# EAGLE board Cube-Panel (EAGLE 7.7.0), part 1 of 2
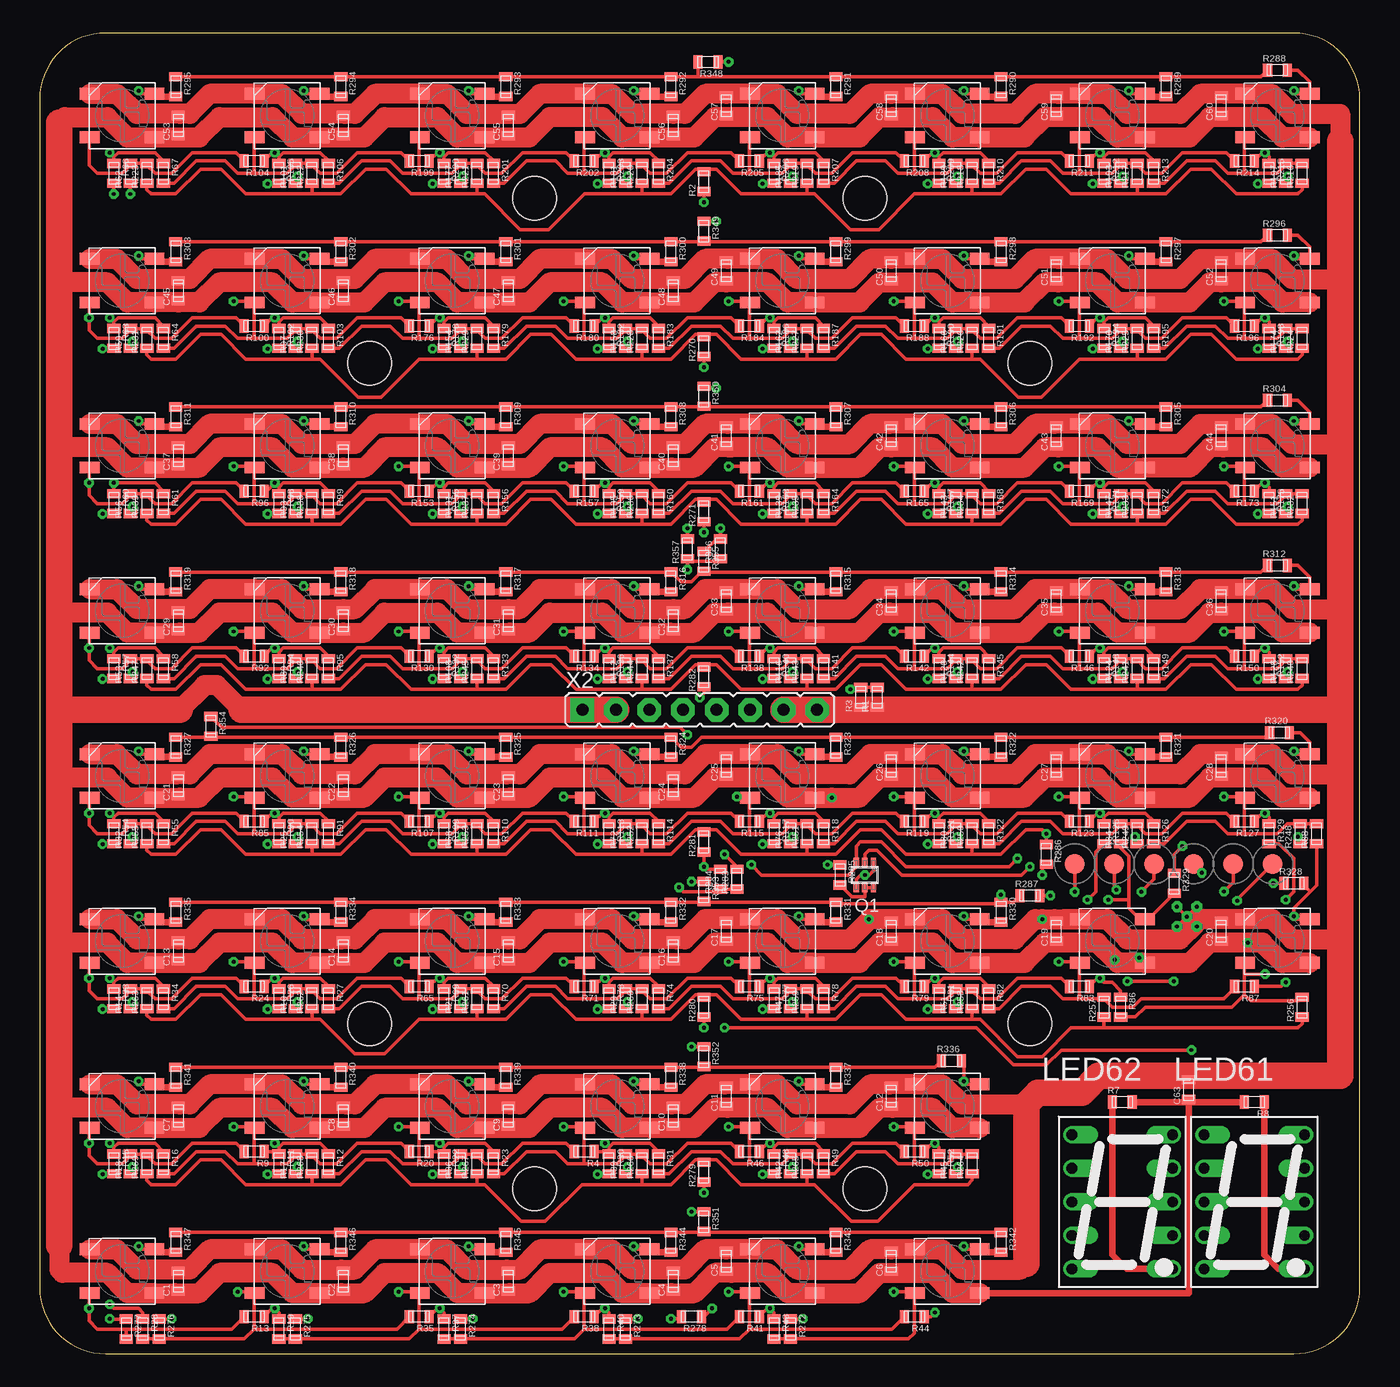
[diagram p8: board, top side]
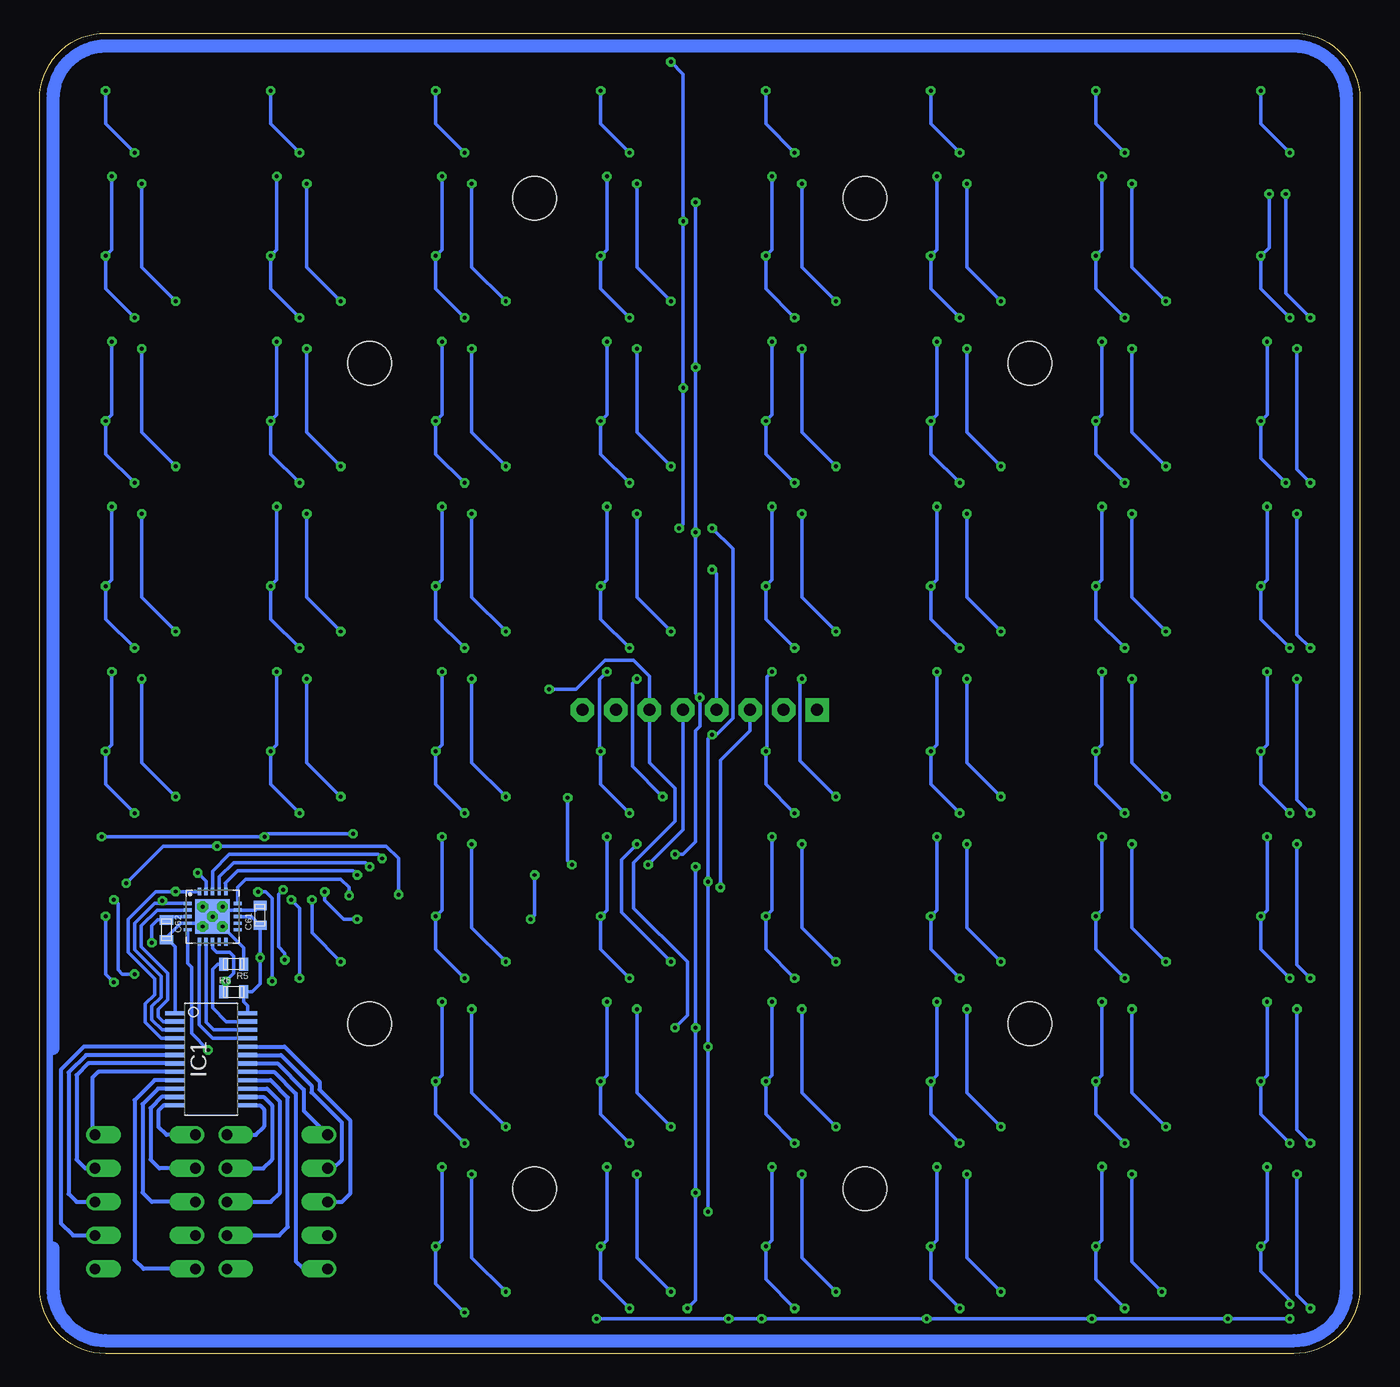
[diagram p9: board, bottom side, seen from below]

Size 100 x 100 mm. Coordinates in mm from the lower left corner, seen from the top.
Outline: 5,0 95,0 arc90 100,5 100,95 arc90 95,100 5,100 arc90 0,95 0,5 arc90 5,0
Copper layers (1*16): Top 0.035mm / dielectric 1.5mm / Bottom 0.035mm
Design rules "default *": minimum track width 0.2mm, minimum drill 0.3mm, track to track 0.2mm, track to pad 0.2mm, pad to pad 0.2mm, via to via 0.2mm, smd to smd 0.2mm, copper to edge 0.5mm, drill to drill 8mil, minimum pad ring 10mil, minimum via ring 8mil, stop-mask expansion 4mil, vias tented up to drill 0.5mm, thermal gap 10mil
Holes 3.3 mm at 25,25 75,25 25,75 75,75 37.5,12.5 62.5,12.5 37.5,87.5 62.5,87.5

## Footprints (pad centres in the part's own frame; a part is rotated, then mirrored left to right if it is on the bottom)
0603 = smd 0.7 x 1: P$1 -0.75,0; P$2 0.75,0
SSOP24-150-0.635 = smd 1.5 x 0.3: 1 -2.75,3.493; 2 -2.75,2.857; 3 -2.75,2.223; 4 -2.75,1.587; 5 -2.75,0.953; 6 -2.75,0.318; 7 -2.75,-0.318; 8 -2.75,-0.953; 9 -2.75,-1.587; 10 -2.75,-2.223; 11 -2.75,-2.857; 12 -2.75,-3.493; 13 2.75,-3.493; 14 2.75,-2.857; 15 2.75,-2.223; 16 2.75,-1.587; 17 2.75,-0.953; 18 2.75,-0.318; 19 2.75,0.318; 20 2.75,0.953; 21 2.75,1.587; 22 2.75,2.223; 23 2.75,2.857; 24 2.75,3.493
QFN-20 = smd 0.6 x 0.25: 1 -1.9,1; 2 -1.9,0.5; 3 -1.9,0; 4 -1.9,-0.5; 5 -1.9,-1; 11 1.9,-1; 12 1.9,-0.5; 13 1.9,0; 14 1.9,0.5; 15 1.9,1 | smd 0.25 x 0.6: 6 -1,-1.9; 7 -0.5,-1.9; 8 0,-1.9; 9 0.5,-1.9; 10 1,-1.9; 16 1,1.9; 17 0.5,1.9; 18 0,1.9; 19 -0.5,1.9; 20 -1,1.9 | smd 2.6 x 2.6: PAD 0,0 | drill 0.3 octagon: PAD$1 0,0; PAD$2 0.75,-0.75; PAD$3 -0.75,-0.75; PAD$4 -0.75,0.75; PAD$5 0.75,0.75
WS2812B = smd 1.5 x 0.9: DIN 2.45,1.65; DOUT -2.45,-1.65; GND 2.45,-1.65; VDD -2.45,1.65
7SEG-13 = drill 0.813 offset: 1 -3.81,5.08; 2 -3.81,2.54; 3 -3.81,0; 4 -3.81,-2.54; 5 -3.81,-5.08; 6 3.81,-5.08; 7 3.81,-2.54; 8 3.81,0; 9 3.81,2.54; 10 3.81,5.08
SOT-363(SC-88) = smd 0.7 x 0.4: 1 0.95,-0.65; 2 0.95,0; 3 0.95,0.65; 4 -0.95,0.65; 5 -0.95,0; 6 -0.95,-0.65
TP[1.5][R] = smd 1.5 x 1.5: P$1 0,0
JP8 = drill 0.914 pad 1.778 square: 1 -8.89,0 | drill 0.914 pad 1.778 octagon: 2 -6.35,0; 3 -3.81,0; 4 -1.27,0; 5 1.27,0; 6 3.81,0; 7 6.35,0; 8 8.89,0

## Placement (x,y rotation side)
C1  [0603]  10.5,5.5 90 top
C2  [0603]  23,5.5 90 top
C3  [0603]  35.5,5.5 90 top
C4  [0603]  48,5.5 90 top
C5  [0603]  52,7 90 top
C6  [0603]  64.5,7 90 top
C7  [0603]  10.5,18 90 top
C8  [0603]  23,18 90 top
C9  [0603]  35.5,18 90 top
C10  [0603]  48,18 90 top
C11  [0603]  52,19.5 90 top
C12  [0603]  64.5,19.5 90 top
C13  [0603]  10.5,30.5 90 top
C14  [0603]  23,30.5 90 top
C15  [0603]  35.5,30.5 90 top
C16  [0603]  48,30.5 90 top
C17  [0603]  52,32 90 top
C18  [0603]  64.5,32 90 top
C19  [0603]  77,32 90 top
C20  [0603]  89.5,32 90 top
C21  [0603]  10.5,43 90 top
C22  [0603]  23,43 90 top
C23  [0603]  35.5,43 90 top
C24  [0603]  48,43 90 top
C25  [0603]  52,44.5 90 top
C26  [0603]  64.5,44.5 90 top
C27  [0603]  77,44.5 90 top
C28  [0603]  89.5,44.5 90 top
C29  [0603]  10.5,55.5 90 top
C30  [0603]  23,55.5 90 top
C31  [0603]  35.5,55.5 90 top
C32  [0603]  48,55.5 90 top
C33  [0603]  52,57 90 top
C34  [0603]  64.5,57 90 top
C35  [0603]  77,57 90 top
C36  [0603]  89.5,57 90 top
C37  [0603]  10.5,68 90 top
C38  [0603]  23,68 90 top
C39  [0603]  35.5,68 90 top
C40  [0603]  48,68 90 top
C41  [0603]  52,69.5 90 top
C42  [0603]  64.5,69.5 90 top
C43  [0603]  77,69.5 90 top
C44  [0603]  89.5,69.5 90 top
C45  [0603]  10.5,80.5 90 top
C46  [0603]  23,80.5 90 top
C47  [0603]  35.5,80.5 90 top
C48  [0603]  48,80.5 90 top
C49  [0603]  52,82 90 top
C50  [0603]  64.5,82 90 top
C51  [0603]  77,82 90 top
C52  [0603]  89.5,82 90 top
C53  [0603]  10.5,93 90 top
C54  [0603]  23,93 90 top
C55  [0603]  35.5,93 90 top
C56  [0603]  48,93 90 top
C57  [0603]  52,94.5 90 top
C58  [0603]  64.5,94.5 90 top
C59  [0603]  77,94.5 90 top
C60  [0603]  89.5,94.5 90 top
C61  [0603]  83.3,33.2 90 bottom
C62  [0603]  90.4,32.1 270 bottom
C63  [0603]  87.03,20 90 top
IC1  MBI5041-GP  [SSOP24-150-0.635]  87,22.3 0 bottom
IC2  ATTINY(261/461/861)V-MAZ  [QFN-20]  86.9,33.1 0 bottom
LED1  WS2812B  [WS2812B]  6.25,6.25 180 top
LED2  WS2812B  [WS2812B]  18.75,6.25 180 top
LED3  WS2812B  [WS2812B]  31.25,6.25 180 top
LED4  WS2812B  [WS2812B]  43.75,6.25 180 top
LED5  WS2812B  [WS2812B]  56.25,6.25 180 top
LED6  WS2812B  [WS2812B]  68.75,6.25 180 top
LED7  WS2812B  [WS2812B]  6.25,18.75 180 top
LED8  WS2812B  [WS2812B]  18.75,18.75 180 top
LED9  WS2812B  [WS2812B]  31.25,18.75 180 top
LED10  WS2812B  [WS2812B]  43.75,18.75 180 top
LED11  WS2812B  [WS2812B]  56.25,18.75 180 top
LED12  WS2812B  [WS2812B]  68.75,18.75 180 top
LED13  WS2812B  [WS2812B]  6.25,31.25 180 top
LED14  WS2812B  [WS2812B]  18.75,31.25 180 top
LED15  WS2812B  [WS2812B]  31.25,31.25 180 top
LED16  WS2812B  [WS2812B]  43.75,31.25 180 top
LED17  WS2812B  [WS2812B]  56.25,31.25 180 top
LED18  WS2812B  [WS2812B]  68.75,31.25 180 top
LED19  WS2812B  [WS2812B]  81.25,31.25 180 top
LED20  WS2812B  [WS2812B]  93.75,31.25 180 top
LED21  WS2812B  [WS2812B]  6.25,43.75 180 top
LED22  WS2812B  [WS2812B]  18.75,43.75 180 top
LED23  WS2812B  [WS2812B]  31.25,43.75 180 top
LED24  WS2812B  [WS2812B]  43.75,43.75 180 top
LED25  WS2812B  [WS2812B]  56.25,43.75 180 top
LED26  WS2812B  [WS2812B]  68.75,43.75 180 top
LED27  WS2812B  [WS2812B]  81.25,43.75 180 top
LED28  WS2812B  [WS2812B]  93.75,43.75 180 top
LED29  WS2812B  [WS2812B]  6.25,56.25 180 top
LED30  WS2812B  [WS2812B]  18.75,56.25 180 top
LED31  WS2812B  [WS2812B]  31.25,56.25 180 top
LED32  WS2812B  [WS2812B]  43.75,56.25 180 top
LED33  WS2812B  [WS2812B]  56.25,56.25 180 top
LED34  WS2812B  [WS2812B]  68.75,56.25 180 top
LED35  WS2812B  [WS2812B]  81.25,56.25 180 top
LED36  WS2812B  [WS2812B]  93.75,56.25 180 top
LED37  WS2812B  [WS2812B]  6.25,68.75 180 top
LED38  WS2812B  [WS2812B]  18.75,68.75 180 top
LED39  WS2812B  [WS2812B]  31.25,68.75 180 top
LED40  WS2812B  [WS2812B]  43.75,68.75 180 top
LED41  WS2812B  [WS2812B]  56.25,68.75 180 top
LED42  WS2812B  [WS2812B]  68.75,68.75 180 top
LED43  WS2812B  [WS2812B]  81.25,68.75 180 top
LED44  WS2812B  [WS2812B]  93.75,68.75 180 top
LED45  WS2812B  [WS2812B]  6.25,81.25 180 top
LED46  WS2812B  [WS2812B]  18.75,81.25 180 top
LED47  WS2812B  [WS2812B]  31.25,81.25 180 top
LED48  WS2812B  [WS2812B]  43.75,81.25 180 top
LED49  WS2812B  [WS2812B]  56.25,81.25 180 top
LED50  WS2812B  [WS2812B]  68.75,81.25 180 top
LED51  WS2812B  [WS2812B]  81.25,81.25 180 top
LED52  WS2812B  [WS2812B]  93.75,81.25 180 top
LED53  WS2812B  [WS2812B]  6.25,93.75 180 top
LED54  WS2812B  [WS2812B]  18.75,93.75 180 top
LED55  WS2812B  [WS2812B]  31.25,93.75 180 top
LED56  WS2812B  [WS2812B]  43.75,93.75 180 top
LED57  WS2812B  [WS2812B]  56.25,93.75 180 top
LED58  WS2812B  [WS2812B]  68.75,93.75 180 top
LED59  WS2812B  [WS2812B]  81.25,93.75 180 top
LED60  WS2812B  [WS2812B]  93.75,93.75 180 top
LED61  INND-TS40AB  [7SEG-13]  92,11.5 0 top
LED62  INND-TS40AB  [7SEG-13]  82,11.5 0 top
Q1  DUAL_BJT_NPN_BIAS-PUMH2  [SOT-363(SC-88)]  62.5,36.25 90 top
R1  [0603]  63.44,49.7 90 top
R2  [0603]  50.31,88.75 90 top
R3  [0603]  62.19,49.7 90 top
R4  [0603]  41.25,15.31 180 top
R5  [0603]  85.3,29.5 180 bottom
R6  [0603]  85.3,27.4 0 bottom
R7  [0603]  82,19.06 0 top
R8  [0603]  92,19.06 180 top
R9  [0603]  16.25,15.31 180 top
R10  [0603]  19.38,26.88 90 top
R11  [0603]  18.12,14.38 270 top
R12  [0603]  21.88,14.38 270 top
R13  [0603]  16.25,2.81 180 top
R14  [0603]  6.88,26.88 90 top
R15  [0603]  5.62,14.38 270 top
R16  [0603]  9.38,14.38 270 top
R17  [0603]  19.38,14.38 90 top
R18  [0603]  6.88,14.38 90 top
R19  [0603]  18.12,1.88 270 top
R20  [0603]  28.75,15.31 180 top
R21  [0603]  31.88,26.88 90 top
R22  [0603]  30.62,14.38 270 top
R23  [0603]  34.38,14.38 270 top
R24  [0603]  16.25,27.81 180 top
R25  [0603]  19.38,39.38 90 top
R26  [0603]  18.12,26.88 270 top
R27  [0603]  21.88,26.88 270 top
R28  [0603]  7.81,1.88 270 top
R29  [0603]  44.38,26.88 90 top
R30  [0603]  43.12,14.38 270 top
R31  [0603]  46.88,14.38 270 top
R32  [0603]  6.88,39.38 90 top
R33  [0603]  5.62,26.88 270 top
R34  [0603]  9.38,26.88 270 top
R35  [0603]  28.75,2.81 180 top
R36  [0603]  31.88,14.38 90 top
R37  [0603]  30.62,1.88 270 top
R38  [0603]  41.25,2.81 180 top
R39  [0603]  44.38,14.38 90 top
R40  [0603]  43.12,1.88 270 top
R41  [0603]  53.75,2.81 180 top
R42  [0603]  56.88,14.38 90 top
R43  [0603]  55.62,1.88 270 top
R44  [0603]  66.25,2.81 180 top
R45  [0603]  69.38,14.38 90 top
R46  [0603]  53.75,15.31 180 top
R47  [0603]  56.88,26.88 90 top
R48  [0603]  55.62,14.38 270 top
R49  [0603]  59.38,14.38 270 top
R50  [0603]  66.25,15.31 180 top
R51  [0603]  69.38,26.88 90 top
R52  [0603]  68.12,14.38 270 top
R53  [0603]  6.88,51.88 90 top
R54  [0603]  5.62,39.38 270 top
R55  [0603]  9.38,39.38 270 top
R56  [0603]  6.88,64.38 90 top
R57  [0603]  5.62,51.88 270 top
R58  [0603]  9.38,51.88 270 top
R59  [0603]  6.88,76.88 90 top
R60  [0603]  5.62,64.38 270 top
R61  [0603]  9.38,64.38 270 top
R62  [0603]  6.88,89.38 90 top
R63  [0603]  5.62,76.88 270 top
R64  [0603]  9.38,76.88 270 top
R65  [0603]  28.75,27.81 180 top
R66  [0603]  5.62,89.38 270 top
R67  [0603]  9.38,89.38 270 top
R68  [0603]  31.88,39.38 90 top
R69  [0603]  30.62,26.88 270 top
R70  [0603]  34.38,26.88 270 top
R71  [0603]  41.25,27.81 180 top
R72  [0603]  44.38,39.38 90 top
R73  [0603]  43.12,26.88 270 top
R74  [0603]  46.88,26.88 270 top
R75  [0603]  53.75,27.81 180 top
R76  [0603]  56.88,39.38 90 top
R77  [0603]  55.62,26.88 270 top
R78  [0603]  59.38,26.88 270 top
R79  [0603]  66.25,27.81 180 top
R80  [0603]  69.38,39.38 90 top
R81  [0603]  68.12,26.88 270 top
R82  [0603]  71.88,26.88 270 top
R83  [0603]  78.75,27.81 180 top
R84  [0603]  81.88,39.38 90 top
R85  [0603]  16.25,40.31 180 top
R86  [0603]  81.88,26.25 270 top
R87  [0603]  91.25,27.81 180 top
R88  [0603]  96.72,39.38 90 top
R89  [0603]  19.38,51.88 90 top
R90  [0603]  18.12,39.38 270 top
R91  [0603]  21.88,39.38 270 top
R92  [0603]  16.25,52.81 180 top
R93  [0603]  19.38,64.38 90 top
R94  [0603]  18.12,51.88 270 top
R95  [0603]  21.88,51.88 270 top
R96  [0603]  16.25,65.31 180 top
R97  [0603]  19.38,76.88 90 top
R98  [0603]  18.12,64.38 270 top
R99  [0603]  21.88,64.38 270 top
R100  [0603]  16.25,77.81 180 top
R101  [0603]  19.38,89.38 90 top
R102  [0603]  18.12,76.88 270 top
R103  [0603]  21.88,76.88 270 top
R104  [0603]  16.25,90.31 180 top
R105  [0603]  18.12,89.38 270 top
R106  [0603]  21.88,89.38 270 top
R107  [0603]  28.75,40.31 180 top
R108  [0603]  31.88,51.88 90 top
R109  [0603]  30.62,39.38 270 top
R110  [0603]  34.38,39.38 270 top
R111  [0603]  41.25,40.31 180 top
R112  [0603]  44.38,51.88 90 top
R113  [0603]  43.12,39.38 270 top
R114  [0603]  46.88,39.38 270 top
R115  [0603]  53.75,40.31 180 top
R116  [0603]  56.88,51.88 90 top
R117  [0603]  55.62,39.38 270 top
R118  [0603]  59.38,39.38 270 top
R119  [0603]  66.25,40.31 180 top
R120  [0603]  69.38,51.88 90 top
R121  [0603]  68.12,39.38 270 top
R122  [0603]  71.88,39.38 270 top
R123  [0603]  78.75,40.31 180 top
R124  [0603]  81.88,51.88 90 top
R125  [0603]  80.62,39.38 270 top
R126  [0603]  84.38,39.38 270 top
R127  [0603]  91.25,40.31 180 top
R128  [0603]  94.38,51.88 90 top
R129  [0603]  93.12,39.38 270 top
R130  [0603]  28.75,52.81 180 top
R131  [0603]  31.88,64.38 90 top
R132  [0603]  30.62,51.88 270 top
R133  [0603]  34.38,51.88 270 top
R134  [0603]  41.25,52.81 180 top
R135  [0603]  44.38,64.38 90 top
R136  [0603]  43.12,51.88 270 top
R137  [0603]  46.88,51.88 270 top
R138  [0603]  53.75,52.81 180 top
R139  [0603]  56.88,64.38 90 top
R140  [0603]  55.62,51.88 270 top
R141  [0603]  59.38,51.88 270 top
R142  [0603]  66.25,52.81 180 top
R143  [0603]  69.38,64.38 90 top
R144  [0603]  68.12,51.88 270 top
R145  [0603]  71.88,51.88 270 top
R146  [0603]  78.75,52.81 180 top
R147  [0603]  81.88,64.38 90 top
R148  [0603]  80.62,51.88 270 top
R149  [0603]  84.38,51.88 270 top
R150  [0603]  91.25,52.81 180 top
R151  [0603]  94.38,64.38 90 top
R152  [0603]  93.12,51.88 270 top
R153  [0603]  28.75,65.31 180 top
R154  [0603]  31.88,76.88 90 top
R155  [0603]  30.62,64.38 270 top
R156  [0603]  34.38,64.38 270 top
R157  [0603]  41.25,65.31 180 top
R158  [0603]  44.38,76.88 90 top
R159  [0603]  43.12,64.38 270 top
R160  [0603]  46.88,64.38 270 top
R161  [0603]  53.75,65.31 180 top
R162  [0603]  56.88,76.88 90 top
R163  [0603]  55.62,64.38 270 top
R164  [0603]  59.38,64.38 270 top
R165  [0603]  66.25,65.31 180 top
R166  [0603]  69.38,76.88 90 top
R167  [0603]  68.12,64.38 270 top
R168  [0603]  71.88,64.38 270 top
R169  [0603]  78.75,65.31 180 top
R170  [0603]  81.88,76.88 90 top
R171  [0603]  80.62,64.38 270 top
R172  [0603]  84.38,64.38 270 top
R173  [0603]  91.25,65.31 180 top
R174  [0603]  94.38,76.88 90 top
R175  [0603]  93.12,64.38 270 top
R176  [0603]  28.75,77.81 180 top
R177  [0603]  31.88,89.38 90 top
R178  [0603]  30.62,76.88 270 top
R179  [0603]  34.38,76.88 270 top
R180  [0603]  41.25,77.81 180 top
R181  [0603]  44.38,89.38 90 top
R182  [0603]  43.12,76.88 270 top
R183  [0603]  46.88,76.88 270 top
R184  [0603]  53.75,77.81 180 top
R185  [0603]  56.88,89.38 90 top
R186  [0603]  55.62,76.88 270 top
R187  [0603]  59.38,76.88 270 top
R188  [0603]  66.25,77.81 180 top
R189  [0603]  69.38,89.38 90 top
R190  [0603]  68.12,76.88 270 top
R191  [0603]  71.88,76.88 270 top
R192  [0603]  78.75,77.81 180 top
R193  [0603]  81.88,89.38 90 top
R194  [0603]  80.62,76.88 270 top
R195  [0603]  84.38,76.88 270 top
R196  [0603]  91.25,77.81 180 top
R197  [0603]  94.38,89.38 90 top
R198  [0603]  93.12,76.88 270 top
R199  [0603]  28.75,90.31 180 top
R200  [0603]  30.62,89.38 270 top
R201  [0603]  34.38,89.38 270 top
R202  [0603]  41.25,90.31 180 top
R203  [0603]  43.12,89.38 270 top
R204  [0603]  46.88,89.38 270 top
R205  [0603]  53.75,90.31 180 top
R206  [0603]  55.62,89.38 270 top
R207  [0603]  59.38,89.38 270 top
R208  [0603]  66.25,90.31 180 top
R209  [0603]  68.12,89.38 270 top
R210  [0603]  71.88,89.38 270 top
R211  [0603]  78.75,90.31 180 top
R212  [0603]  80.62,89.38 270 top
R213  [0603]  84.38,89.38 270 top
R214  [0603]  91.25,90.31 180 top
R215  [0603]  93.12,89.38 270 top
R216  [0603]  95.62,89.38 90 top
R217  [0603]  83.12,89.38 90 top
R218  [0603]  70.62,89.38 90 top
R219  [0603]  58.12,89.38 90 top
R220  [0603]  45.62,89.38 90 top
R221  [0603]  33.12,89.38 90 top
R222  [0603]  20.62,89.38 90 top
R223  [0603]  8.12,89.38 90 top
R224  [0603]  95.62,76.88 90 top
R225  [0603]  83.12,76.88 90 top
R226  [0603]  70.62,76.88 90 top
R227  [0603]  58.12,76.88 90 top
R228  [0603]  45.62,76.88 90 top
R229  [0603]  33.12,76.88 90 top
R230  [0603]  20.62,76.88 90 top
R231  [0603]  8.12,76.88 90 top
R232  [0603]  95.62,64.38 90 top
R233  [0603]  83.12,64.38 90 top
R234  [0603]  70.62,64.38 90 top
R235  [0603]  58.12,64.38 90 top
R236  [0603]  45.62,64.38 90 top
R237  [0603]  33.12,64.38 90 top
R238  [0603]  20.62,64.38 90 top
R239  [0603]  8.12,64.38 90 top
R240  [0603]  95.62,51.88 90 top
R241  [0603]  83.12,51.88 90 top
R242  [0603]  70.62,51.88 90 top
R243  [0603]  58.12,51.88 90 top
R244  [0603]  45.62,51.88 90 top
R245  [0603]  33.12,51.88 90 top
R246  [0603]  20.62,51.88 90 top
R247  [0603]  8.12,51.88 90 top
R248  [0603]  95.47,39.38 90 top
R249  [0603]  83.12,39.38 90 top
R250  [0603]  70.62,39.38 90 top
R251  [0603]  58.12,39.38 90 top
R252  [0603]  45.62,39.38 90 top
R253  [0603]  33.12,39.38 90 top
R254  [0603]  20.62,39.38 90 top
R255  [0603]  8.12,39.38 90 top
R256  [0603]  95.62,26.25 90 top
R257  [0603]  80.62,26.25 90 top
R258  [0603]  70.62,26.88 90 top
R259  [0603]  58.12,26.88 90 top
R260  [0603]  45.62,26.88 90 top
R261  [0603]  33.12,26.88 90 top
R262  [0603]  20.62,26.88 90 top
R263  [0603]  8.12,26.88 90 top
R264  [0603]  70.62,14.38 90 top
R265  [0603]  58.12,14.38 90 top
R266  [0603]  45.62,14.38 90 top
R267  [0603]  33.12,14.38 90 top
R268  [0603]  20.62,14.38 90 top
R269  [0603]  8.12,14.38 90 top
R270  [0603]  50.31,76.25 90 top
R271  [0603]  50.31,63.75 90 top
R272  [0603]  56.88,1.88 270 top
R273  [0603]  44.38,1.88 270 top
R274  [0603]  31.88,1.88 270 top
R275  [0603]  19.38,1.88 270 top
R276  [0603]  9.06,1.88 270 top
R277  [0603]  6.56,1.88 270 top
R278  [0603]  49.38,2.81 180 top
R279  [0603]  50.31,13.75 90 top
R280  [0603]  50.31,26.25 90 top
R281  [0603]  50.31,38.75 90 top
R282  [0603]  50.31,51.25 90 top
R283  [0603]  52.81,35.94 90 top
R284  [0603]  51.56,35.94 90 top
R285  [0603]  60.62,36.25 270 top
R286  [0603]  76.25,37.81 270 top
R287  [0603]  75,34.69 0 top
R288  [0603]  93.75,97.19 0 top
R289  [0603]  85.31,95.94 270 top
R290  [0603]  72.81,95.94 270 top
R291  [0603]  60.31,95.94 270 top
R292  [0603]  47.81,95.94 270 top
R293  [0603]  35.31,95.94 270 top
R294  [0603]  22.81,95.94 270 top
R295  [0603]  10.31,95.94 270 top
R296  [0603]  93.75,84.69 0 top
R297  [0603]  85.31,83.44 270 top
R298  [0603]  72.81,83.44 270 top
R299  [0603]  60.31,83.44 270 top
R300  [0603]  47.81,83.44 270 top
R301  [0603]  35.31,83.44 270 top
R302  [0603]  22.81,83.44 270 top
R303  [0603]  10.31,83.44 270 top
R304  [0603]  93.75,72.19 0 top
R305  [0603]  85.31,70.94 270 top
R306  [0603]  72.81,70.94 270 top
R307  [0603]  60.31,70.94 270 top
R308  [0603]  47.81,70.94 270 top
R309  [0603]  35.31,70.94 270 top
R310  [0603]  22.81,70.94 270 top
R311  [0603]  10.31,70.94 270 top
R312  [0603]  93.75,59.69 0 top
R313  [0603]  85.31,58.44 270 top
R314  [0603]  72.81,58.44 270 top
R315  [0603]  60.31,58.44 270 top
R316  [0603]  47.81,58.44 270 top
R317  [0603]  35.31,58.44 270 top
R318  [0603]  22.81,58.44 270 top
R319  [0603]  10.31,58.44 270 top
R320  [0603]  93.91,47.03 0 top
R321  [0603]  85.31,45.94 270 top
R322  [0603]  72.81,45.94 270 top
R323  [0603]  60.31,45.94 270 top
R324  [0603]  47.81,45.94 270 top
R325  [0603]  35.31,45.94 270 top
R326  [0603]  22.81,45.94 270 top
R327  [0603]  10.31,45.94 270 top
R328  [0603]  95,35.62 0 top
R329  [0603]  85.94,35.62 270 top
R330  [0603]  72.81,33.44 270 top
R331  [0603]  60.31,33.44 270 top
R332  [0603]  47.81,33.44 270 top
R333  [0603]  35.31,33.44 270 top
R334  [0603]  22.81,33.44 270 top
R335  [0603]  10.31,33.44 270 top
R336  [0603]  69.06,22.19 0 top
R337  [0603]  60.31,20.94 270 top
R338  [0603]  47.81,20.94 270 top
R339  [0603]  35.31,20.94 270 top
R340  [0603]  22.81,20.94 270 top
R341  [0603]  10.31,20.94 270 top
R342  [0603]  72.81,8.44 270 top
R343  [0603]  60.31,8.44 270 top
R344  [0603]  47.81,8.44 270 top
R345  [0603]  35.31,8.44 270 top
R346  [0603]  22.81,8.44 270 top
R347  [0603]  10.31,8.44 270 top
R348  [0603]  50.62,97.81 180 top
R349  [0603]  50.31,85 270 top
R350  [0603]  50.31,72.5 270 top
R351  [0603]  50.31,10 270 top
R352  [0603]  50.31,22.5 270 top
R353  [0603]  50.31,35 270 top
R354  [0603]  12.97,47.5 270 top
R355  [0603]  50.31,60 270 top
R356  [0603]  51.56,60.94 90 top
R357  [0603]  49.06,60.94 90 top
TP1  TP  [TP[1.5][R]]  81.4,37.1 0 top
TP2  TP  [TP[1.5][R]]  84.4,37.1 0 top
TP3  TP  [TP[1.5][R]]  87.4,37.1 0 top
TP4  TP  [TP[1.5][R]]  90.4,37.1 0 top
TP5  TP  [TP[1.5][R]]  93.4,37.1 0 top
TP6  TP  [TP[1.5][R]]  78.4,37.1 0 top
X2  JP8ER  [JP8]  50,48.75 0 top

## Tracks (layer width: path | path; a pad name or v marks a point on that pad's centre or on a via)
A1
  Bottom 0.3: LED62.10 83.62,16.58 83,17.2 83,18.5 83.31,18.81 IC1.13
A2
  Bottom 0.3: IC1.8 95.55,21.35 96,20.9 96,16.77 LED61.10
B1
  Bottom 0.3: LED62.9 83.06,14.04 82.4,14.7 82.4,18.8 83.04,19.44 IC1.14
B2
  Bottom 0.3: LED61.9 96.54,14.04 97.2,14.7 97.2,21.1 96.32,21.98 IC1.7
C1
  Bottom 0.3: LED62.8 82.5,11.5 81.8,12.2 81.8,19.1 82.78,20.08 IC1.15
C2
  Bottom 0.3: IC1.6 96.48,22.62 97.8,21.3 97.8,12.1 97.2,11.5 LED61.8
D1
  Bottom 0.3: LED62.5 80.02,6.42 80.6,7 80.6,19.7 82.25,21.35 IC1.17
D2
  Bottom 0.3: LED61.5 92.12,6.42 92.8,7.1 92.8,19.2 91.29,20.71 IC1.9
E1
  Bottom 0.3: LED62.1 80,18.39 80,20 81.98,21.98 IC1.18
E2
  Bottom 0.3: LED61.1 90.38,16.58 91,17.2 91,18.4 90.59,18.81 IC1.12
F1
  Bottom 0.3: LED62.2 77.76,14.04 77.1,14.7 77.1,17.5 79.4,19.8 79.4,20.3 81.72,22.62 IC1.19
F2
  Bottom 0.3: LED61.2 90.94,14.04 91.6,14.7 91.6,18.6 90.76,19.44 IC1.11
G1
  Bottom 0.3: LED62.3 77.1,11.5 76.5,12.1 76.5,17.7 78.8,20 78.8,20.6 81.45,23.25 IC1.20
G2
  Bottom 0.3: LED61.3 91.5,11.5 92.2,12.2 92.2,18.9 91.02,20.08 IC1.10
GCLK
  Bottom 0.25: IC1.21 86.89,23.89 87.9,24.9 IC2.6
GND  (via drill 0.3)
  Top 0.25: IC2.PAD$5 IC2.PAD | IC2.PAD IC2.PAD$4 | IC2.PAD$2 IC2.PAD | 87.9,32.9 87.7,33.1 IC2.PAD | TP6.P$1 v78.4,34.98 | C20.P$2 89.5,32.89 | R3.P$1 62.19,48.75 | R1.P$1 63.44,48.75 | v62.81,32.9 62.81,32.81 | Q1.4 61.85,35.91 62.19,36.25 v62.5,36.25 62.81,36.25 63.15,36.59 Q1.1
  Top 0.5: C21.P$2 10.38,43.88 | C22.P$2 22.88,43.88 | C23.P$2 35.38,43.88 | C24.P$2 48.12,43.88 | C25.P$2 52.1,45.25 52.25,45.4 | C26.P$2 64.5,45.27 64.62,45.4 | C27.P$2 77.1,45.25 77.25,45.4 | C28.P$2 89.5,45.27 89.62,45.4 | C36.P$2 89.5,57.77 89.62,57.9 | C35.P$2 77,57.77 76.88,57.9 | C34.P$2 64.5,57.9 | C33.P$2 51.77,57.75 51.62,57.9 | C32.P$2 48,56.38 | C31.P$2 35.5,56.38 | C30.P$2 23,56.38 | C29.P$2 10.62,56.38 | C37.P$2 10.75,68.75 10.88,68.88 | C38.P$2 23.12,68.75 23.25,68.88 | C39.P$2 35.38,68.88 | C40.P$2 48.12,68.88 | C41.P$2 52,70.28 52.12,70.4 | C42.P$2 64.5,70.28 64.38,70.4 | C43.P$2 77,70.28 76.88,70.4 | C44.P$2 89.5,70.4 | C52.P$2 89.5,82.9 | C51.P$2 77,82.78 77.12,82.9 | C50.P$2 64.5,82.9 | C49.P$2 52,82.78 52.12,82.9 | C48.P$2 48,81.38 | C47.P$2 35.38,81.38 | C46.P$2 22.88,81.38 | C45.P$2 10.5,81.38 | C53.P$2 10.62,93.88 | C54.P$2 23,94.25 23.12,94.38 23.12,93.88 | C55.P$2 35.38,93.88 | C56.P$2 48,93.88 | C57.P$2 52,95.4 | C58.P$2 64.5,95.4 | C59.P$2 77,95.28 77.12,95.4 | C60.P$2 89.6,95.25 89.75,95.4 | C19.P$2 77,32.77 76.88,32.9 | C18.P$2 64.72,32.75 64.88,32.9 | C17.P$2 52,32.77 51.88,32.9 | C16.P$2 48.12,31.25 48.25,31.38 | C15.P$2 35.5,31.38 | C14.P$2 22.88,31.38 | C13.P$2 10.5,31.38 | C7.P$2 10.62,18.88 | C8.P$2 23.12,18.75 23.25,18.88 | C9.P$2 35.62,18.88 | C10.P$2 47.88,18.88 | C11.P$2 52,20.27 51.88,20.4 | C12.P$2 64.5,20.27 64.38,20.4 | C6.P$2 64.5,7.9 | C5.P$2 52,7.9 | C4.P$2 47.75,6.25 47.62,6.38 | C3.P$2 35.38,6.38 | C2.P$2 22.88,6.38 | C1.P$2 10.12,6.25 10,6.38 | C20.P$2 89.65,32.9 90,32.9 | IC2.PAD$3 87.5,32.5 | C63.P$2 86.88,20.75 86.88,21.05
  Top 1.5: LED53.GND 5.85,95.4 7.38,93.88 10.62,93.88 11.38,93.88 12.9,95.4 LED54.GND 18.35,95.4 19.88,93.88 23.12,93.88 23.88,93.88 25.4,95.4 LED55.GND 30.85,95.4 32.38,93.88 35.38,93.88 36.38,93.88 37.9,95.4 LED56.GND 43.35,95.4 44.88,93.88 48,93.88 48.88,93.88 50.4,95.4 52,95.4 LED57.GND 55.85,95.4 57.38,93.88 61.38,93.88 62.9,95.4 64.5,95.4 LED58.GND 68.35,95.4 69.88,93.88 73.88,93.88 75.4,95.4 77.12,95.4 LED59.GND 80.85,95.4 82.38,93.88 86.38,93.88 87.9,95.4 89.75,95.4 LED60.GND 93.35,95.4 94.88,93.88 98.5,93.88 98.5,91.8 | LED45.GND 5.85,82.9 7.38,81.38 10.5,81.38 11.38,81.38 12.9,82.9 LED46.GND 18.35,82.9 19.88,81.38 22.88,81.38 23.88,81.38 25.4,82.9 LED47.GND 30.85,82.9 32.38,81.38 35.38,81.38 36.38,81.38 37.9,82.9 LED48.GND 43.35,82.9 44.88,81.38 48,81.38 48.88,81.38 50.4,82.9 52.12,82.9 LED49.GND 55.85,82.9 57.38,81.38 61.38,81.38 62.9,82.9 64.5,82.9 LED50.GND 68.35,82.9 69.88,81.38 73.88,81.38 75.4,82.9 77.12,82.9 LED51.GND 80.85,82.9 82.38,81.38 86.38,81.38 87.9,82.9 89.5,82.9 LED52.GND 93.35,82.9 94.88,81.38 98.38,81.38 98.5,81.5 | LED37.GND 5.85,70.4 7.38,68.88 10.88,68.88 11.38,68.88 12.9,70.4 LED38.GND 18.35,70.4 19.88,68.88 23.25,68.88 23.88,68.88 25.4,70.4 LED39.GND 30.85,70.4 32.38,68.88 35.38,68.88 36.38,68.88 37.9,70.4 LED40.GND 43.35,70.4 44.88,68.88 48.12,68.88 48.88,68.88 50.4,70.4 52.12,70.4 LED41.GND 55.85,70.4 57.38,68.88 61.38,68.88 62.9,70.4 64.38,70.4 LED42.GND 68.35,70.4 69.88,68.88 73.88,68.88 75.4,70.4 76.88,70.4 LED43.GND 80.85,70.4 82.38,68.88 86.38,68.88 87.9,70.4 89.5,70.4 LED44.GND 93.35,70.4 94.88,68.88 98.38,68.88 98.5,68.75
  Top 1.5: 98.5,56.25 98.38,56.38 94.88,56.38 93.35,57.9 LED36.GND 89.62,57.9 87.9,57.9 86.38,56.38 82.38,56.38 80.85,57.9 LED35.GND 76.88,57.9 75.4,57.9 73.88,56.38 69.88,56.38 68.35,57.9 LED34.GND 64.5,57.9 62.9,57.9 61.38,56.38 57.38,56.38 55.85,57.9 LED33.GND 51.62,57.9 50.4,57.9 48.88,56.38 48,56.38 44.88,56.38 43.35,57.9 LED32.GND 37.9,57.9 36.38,56.38 35.5,56.38 32.38,56.38 30.85,57.9 LED31.GND 25.4,57.9 23.88,56.38 23,56.38 19.88,56.38 18.35,57.9 LED30.GND 12.9,57.9 11.38,56.38 10.62,56.38 7.38,56.38 5.85,57.9 LED29.GND | LED21.GND 5.85,45.4 7.38,43.88 10.38,43.88 11.38,43.88 12.9,45.4 LED22.GND 18.35,45.4 19.88,43.88 22.88,43.88 23.88,43.88 25.4,45.4 LED23.GND 30.85,45.4 32.38,43.88 35.38,43.88 36.38,43.88 37.9,45.4 LED24.GND 43.35,45.4 44.88,43.88 48.12,43.88 48.88,43.88 50.4,45.4 52.25,45.4 LED25.GND 55.85,45.4 57.38,43.88 61.38,43.88 62.9,45.4 64.62,45.4 LED26.GND 68.35,45.4 69.88,43.88 73.88,43.88 75.4,45.4 77.25,45.4 LED27.GND 80.85,45.4 82.38,43.88 86.38,43.88 87.9,45.4 89.62,45.4 LED28.GND 93.35,45.4 94.88,43.88 98.5,43.88 | 98.5,31.25 98.38,31.38 94.88,31.38 93.35,32.9 LED20.GND 90,32.9 87.9,32.9 87.5,32.5 86.38,31.38 82.38,31.38 80.85,32.9 LED19.GND | 74.72,18.88 69.88,18.88 68.35,20.4 LED12.GND 64.38,20.4 62.9,20.4 61.38,18.88 57.38,18.88 55.85,20.4 LED11.GND 51.88,20.4 50.4,20.4 48.88,18.88 47.88,18.88 44.88,18.88 43.35,20.4 LED10.GND 37.9,20.4 36.38,18.88 35.62,18.88 32.38,18.88 30.85,20.4 LED9.GND 25.4,20.4 23.88,18.88 23.25,18.88 19.88,18.88 18.35,20.4 LED8.GND 12.9,20.4 11.38,18.88 10.62,18.88 7.38,18.88 5.85,20.4 LED7.GND
  Top 1.5: 74.72,6.8 74.3,6.38 69.88,6.38 68.35,7.9 LED6.GND 64.5,7.9 62.9,7.9 61.38,6.38 57.38,6.38 55.85,7.9 LED5.GND 52,7.9 50.4,7.9 48.88,6.38 47.62,6.38 44.88,6.38 43.35,7.9 LED4.GND 37.9,7.9 36.38,6.38 35.38,6.38 32.38,6.38 30.85,7.9 LED3.GND 25.4,7.9 23.88,6.38 22.88,6.38 19.88,6.38 18.35,7.9 LED2.GND 12.9,7.9 11.38,6.38 10,6.38 7.38,6.38 5.85,7.9 LED1.GND | LED13.GND 5.85,32.9 7.38,31.38 10.5,31.38 11.38,31.38 12.9,32.9 LED14.GND 18.35,32.9 19.88,31.38 22.88,31.38 23.88,31.38 25.4,32.9 LED15.GND 30.85,32.9 32.38,31.38 35.5,31.38 36.38,31.38 37.9,32.9 LED16.GND 43.35,32.9 44.88,31.38 48.25,31.38 48.88,31.38 50.4,32.9 51.88,32.9 LED17.GND 55.85,32.9 57.38,31.38 61.38,31.38 62.81,32.81 62.9,32.9 64.88,32.9 LED18.GND 68.35,32.9 69.88,31.38 73.88,31.38 75.4,32.9 v75.94,32.9 76.88,32.9 LED19.GND | LED19.GND 77.6,32.9
  Top 2: 98.5,91.8 98.5,81.5 98.5,68.75 98.5,56.25 98.5,48.75 | 98.5,48.75 98.5,43.88 98.5,31.25 98.5,21.05 86.88,21.05 80.2,21.05 78.92,19.77 75.62,19.77 74.72,18.88 74.72,6.8 | X2.7 X2.8 62.19,48.75 63.44,48.75 98.5,48.75
  Bottom 0.25: IC1.1 89.75,30.8 90.3,31.35 C62.P$2 90.4,31.5 89.3,32.6 IC2.4 87.9,32.6 IC2.PAD$3 | C61.P$2 83.65,33.6 IC2.14 85.9,33.6 IC2.PAD$5 | R5.P$1 84.55,30.75 IC2.PAD$2 | v78.4,34.98 78.4,34.33 76.97,32.9 v75.94,32.9 | v62.5,36.25 62.5,33.21 v62.81,32.9
H1
  Bottom 0.3: LED62.7 81.84,8.96 81.2,9.6 81.2,19.4 82.51,20.71 IC1.16
H2
  Bottom 0.3: IC1.5 96.65,23.25 98.4,21.5 98.4,9.9 97.46,8.96 LED61.7
ID-SENSE  (via drill 0.3)
  Top 0.25: R1.P$2 R3.P$2 61.55,50.45 v61.41,50.31 | v87.25,23 77.38,23 76.25,21.88 73.75,21.88 70.94,24.69 v51.88,24.69
  Bottom 0.25: v61.41,50.31 59.38,50.31 57.19,52.5 55,52.5 53.81,51.31 X2.6 53.81,44.75 51.88,42.81 51.88,40.31 55,37.19 55,33.75 50.94,29.69 50.94,25.62 v51.88,24.69 | IC2.5 88.8,29.55 88.5,29.25 88.5,24.25 v87.25,23
IN1  (via drill 0.3)
  Top 0.25: 6.56,1.88 4.38,1.88 3.75,2.5 v3.75,3.44 3.75,4.55 LED1.DIN | 6.56,1.88 14.56,1.88 R13.P$2 | R15.P$2 4.8,13.62 v4.77,13.59 | R277.P$2 6.56,1.88
  Bottom 0.25: v4.77,13.59 4.77,4.45 v3.75,3.44
IN2  (via drill 0.3)
  Top 0.25: 16.25,4.55 16.11,4.69 v15,4.69 | R35.P$2 27.06,1.88 16.25,1.88 | LED2.DIN 16.25,4.55 | 16.25,4.55 16.25,1.88 | R11.P$2 17.3,13.62 v17.27,13.59 | 16.25,1.88 15.5,1.12 R28.P$2 R276.P$2
  Bottom 0.25: v17.27,13.59 17.27,6.95 v15,4.69
IN3  (via drill 0.3)
  Top 0.25: v27.19,4.69 28.71,4.69 LED3.DIN 28.75,4.55 28.75,1.88 | R38.P$2 39.56,1.88 28.75,1.88 | R22.P$2 29.8,13.62 v29.77,13.59 | 28.75,1.88 28,1.12 R275.P$2 R19.P$2
  Bottom 0.25: v29.77,13.59 29.77,7.27 v27.19,4.69
IN4  (via drill 0.3)
  Top 0.25: v39.69,4.69 41.21,4.69 LED4.DIN 41.25,4.55 41.25,1.88 | R41.P$2 52.06,1.88 41.25,1.88 | R30.P$2 42.3,13.62 v42.27,13.59 | 41.25,1.88 40.5,1.12 R274.P$2 R37.P$2
  Bottom 0.25: v42.27,13.59 42.27,7.27 v39.69,4.69
IN5  (via drill 0.3)
  Top 0.25: v52.19,4.69 53.71,4.69 LED5.DIN 53.75,4.55 53.75,1.88 | R44.P$2 64.56,1.88 53.75,1.88 | R48.P$2 54.8,13.62 v54.77,13.59 | 53.75,1.88 53,1.12 R273.P$2 R40.P$2
  Bottom 0.25: v54.77,13.59 54.77,7.27 v52.19,4.69
IN6  (via drill 0.3)
  Top 0.25: v64.69,4.69 66.21,4.69 LED6.DIN 66.25,4.55 66.25,1.56 65.81,1.12 R272.P$2 R43.P$2 | R52.P$2 67.3,13.62 v67.27,13.59
  Bottom 0.25: v67.27,13.59 67.27,7.27 v64.69,4.69
IN7  (via drill 0.3)
  Top 0.25: LED7.DIN 3.75,17.05 v3.75,15.94 3.75,15 4.38,14.38 6.25,14.38 6.88,15 R18.P$2 R269.P$2 8.12,15 8.75,14.38 10,14.38 11.56,15.94 14.88,15.94 R9.P$2 | R33.P$2 4.8,26.12 v4.77,26.09
  Bottom 0.25: v4.77,26.09 4.77,16.95 v3.75,15.94
IN8  (via drill 0.3)
  Top 0.25: 16.25,14.38 16.25,17.05 LED8.DIN 16.21,17.19 v14.69,17.19 | 16.25,14.38 15,14.38 14.06,15.31 11.88,15.31 10.19,13.62 R16.P$2 | R20.P$2 27.38,15.94 24.06,15.94 22.5,14.38 21.25,14.38 20.62,15 R268.P$2 R17.P$2 19.38,15 18.75,14.38 16.25,14.38 | R26.P$2 17.3,26.12 v17.27,26.09
  Bottom 0.25: v17.27,26.09 17.27,19.77 v14.69,17.19
IN9  (via drill 0.3)
  Top 0.25: 28.75,14.38 28.75,17.05 LED9.DIN 28.71,17.19 v27.19,17.19 | 28.75,14.38 27.5,14.38 26.56,15.31 24.38,15.31 22.69,13.62 R12.P$2 | R4.P$2 39.88,15.94 36.56,15.94 35,14.38 33.75,14.38 33.12,15 | 28.75,14.38 31.25,14.38 31.88,15 R36.P$2 R267.P$2 33.12,15 | 33.12,15 33.25,15 | R69.P$2 29.8,26.12 v29.77,26.09
  Bottom 0.25: v29.77,26.09 29.77,19.77 v27.19,17.19
IN10  (via drill 0.3)
  Top 0.25: 41.25,14.38 41.25,17.05 LED10.DIN 41.21,17.19 v39.69,17.19 | 41.25,14.38 40,14.38 39.06,15.31 36.88,15.31 35.19,13.62 R23.P$2 | R46.P$2 52.38,15.94 49.06,15.94 47.5,14.38 46.25,14.38 45.62,15 | 41.25,14.38 43.75,14.38 44.38,15 | 44.38,15 44.25,15 | 45.62,15 45.75,15 | 44.38,15 R39.P$2 R266.P$2 45.62,15 | R73.P$2 42.3,26.12 v42.27,26.09
  Bottom 0.25: v42.27,26.09 42.27,19.77 v39.69,17.19
IN11  (via drill 0.3)
  Top 0.25: 53.75,14.38 53.75,17.05 LED11.DIN 53.71,17.19 v52.19,17.19 | R31.P$2 47.69,13.62 49.38,15.31 51.56,15.31 52.5,14.38 53.75,14.38 | R50.P$2 64.88,15.94 61.56,15.94 60,14.38 58.75,14.38 58.12,15 | 53.75,14.38 56.25,14.38 56.88,15 | 56.88,15 56.75,15 | 58.12,15 58.25,15 | 58.12,15 R265.P$2 R42.P$2 56.88,15 | R77.P$2 54.8,26.12 v54.77,26.09
  Bottom 0.25: v54.77,26.09 54.77,19.77 v52.19,17.19
IN12  (via drill 0.3)
  Top 0.25: R49.P$2 60.19,13.62 61.88,15.31 64.06,15.31 65,14.38 66.25,14.38 | 66.25,14.38 66.25,17.05 LED12.DIN 66.21,17.19 v64.69,17.19 | R264.P$2 R45.P$2 69.38,15 68.75,14.38 66.25,14.38 | R81.P$2 67.3,26.12 v67.27,26.09
  Bottom 0.25: v67.27,26.09 67.27,19.77 v64.69,17.19
IN13  (via drill 0.3)
  Top 0.25: LED13.DIN 3.75,29.55 v3.75,28.44 3.75,27.5 4.38,26.88 6.25,26.88 6.88,27.5 R14.P$2 R263.P$2 8.12,27.5 8.75,26.88 10,26.88 11.56,28.44 14.88,28.44 R24.P$2 | R54.P$2 4.8,38.62 v4.77,38.59
  Bottom 0.25: v4.77,38.59 4.77,29.45 v3.75,28.44
IN14  (via drill 0.3)
  Top 0.25: 16.25,26.88 16.25,29.55 LED14.DIN 16.21,29.69 v14.69,29.69 | R65.P$2 27.38,28.44 24.06,28.44 22.5,26.88 21.25,26.88 20.62,27.5 R262.P$2 R10.P$2 19.38,27.5 18.75,26.88 16.25,26.88 | R34.P$2 10.19,26.12 11.88,27.81 14.06,27.81 15,26.88 16.25,26.88 | R90.P$2 17.3,38.62 v17.27,38.59
  Bottom 0.25: v17.27,38.59 17.27,32.27 v14.69,29.69
IN15  (via drill 0.3)
  Top 0.25: 28.75,26.88 28.75,29.55 LED15.DIN 28.71,29.69 v27.19,29.69 | R71.P$2 39.88,28.44 36.56,28.44 35,26.88 33.75,26.88 33.12,27.5 R261.P$2 R21.P$2 31.88,27.5 31.25,26.88 28.75,26.88 | R27.P$2 22.69,26.12 24.38,27.81 26.56,27.81 27.5,26.88 28.75,26.88 | R109.P$2 29.8,38.62 v29.77,38.59
  Bottom 0.25: v29.77,38.59 29.77,32.27 v27.19,29.69
IN16  (via drill 0.3)
  Top 0.25: 41.25,26.88 41.25,29.55 LED16.DIN 41.21,29.69 v39.69,29.69 | R75.P$2 52.38,28.44 49.06,28.44 47.5,26.88 46.25,26.88 45.62,27.5 R260.P$2 R29.P$2 44.38,27.5 43.75,26.88 41.25,26.88 | R70.P$2 35.19,26.12 36.88,27.81 39.06,27.81 40,26.88 41.25,26.88 | R113.P$2 42.3,38.62 v42.27,38.59
  Bottom 0.25: v42.27,38.59 42.27,32.27 v39.69,29.69
IN17  (via drill 0.3)
  Top 0.25: 53.75,26.88 53.75,29.55 LED17.DIN 53.71,29.69 v52.19,29.69 | R79.P$2 64.88,28.44 61.56,28.44 60,26.88 58.75,26.88 58.12,27.5 R259.P$2 R47.P$2 56.88,27.5 56.25,26.88 53.75,26.88 | R74.P$2 47.69,26.12 49.38,27.81 51.56,27.81 52.5,26.88 53.75,26.88 | R117.P$2 54.8,38.62 v54.77,38.59
  Bottom 0.25: v52.19,29.69 55.94,33.44 55.94,37.42 v54.77,38.59
IN18  (via drill 0.3)
  Top 0.25: 66.25,26.88 66.25,29.55 LED18.DIN 66.21,29.69 v64.69,29.69 | R83.P$2 77.38,28.44 74.06,28.44 72.5,26.88 71.25,26.88 70.62,27.5 R258.P$2 R51.P$2 69.38,27.5 68.75,26.88 66.25,26.88 | R78.P$2 60.19,26.12 61.88,27.81 64.06,27.81 65,26.88 66.25,26.88 | R121.P$2 67.3,38.62 v67.27,38.59
  Bottom 0.25: v67.27,38.59 67.27,32.27 v64.69,29.69
IN19  (via drill 0.3)
  Top 0.25: 78.75,26.88 78.75,29.55 LED19.DIN 78.71,29.69 v77.19,29.69 | R87.P$2 90.62,27.81 89.69,26.88 83.44,26.88 82.81,26.25 81.25,26.25 80.62,26.88 | R82.P$2 72.69,26.12 74.38,27.81 76.56,27.81 77.5,26.88 78.75,26.88 | 80.62,26.88 78.75,26.88 | 80.62,26.88 R257.P$2 | v79.38,34.38 80,35 80,38 R125.P$2
  Bottom 0.25: v77.19,29.69 79.38,31.88 v79.38,34.38
IN20  (via drill 0.3)
  Top 0.25: LED20.DIN 91.25,29.55 91.25,28.75 | 91.25,28.75 91.25,27.19 | 91.25,27.19 90.31,26.25 83.75,26.25 83,25.5 R86.P$2 | R129.P$2 93.88,38.62 95,37.5 95,35 v94.38,34.38 | v92.81,28.75 91.25,28.75 | R256.P$2 95.34,26.72 91.72,26.72 91.25,27.19
  Bottom 0.25: v94.38,34.38 94.06,34.06 94.06,29.06 93.75,28.75 v92.81,28.75
IN21  (via drill 0.3)
  Top 0.25: LED21.DIN 3.75,42.1 v3.75,40.94 3.75,40 4.38,39.38 6.25,39.38 6.88,40 R32.P$2 R255.P$2 8.12,40 8.75,39.38 10,39.38 11.56,40.94 14.88,40.94 R85.P$2 | R57.P$2 4.8,51.12 v4.77,51.09
  Bottom 0.25: v4.77,51.09 4.77,41.95 v3.75,40.94
IN22  (via drill 0.3)
  Top 0.25: 16.25,39.38 16.25,42.1 LED22.DIN 16.21,42.19 v14.69,42.19 | R107.P$2 27.38,40.94 24.06,40.94 22.5,39.38 21.25,39.38 20.62,40 R254.P$2 R25.P$2 19.38,40 18.75,39.38 16.25,39.38 | R55.P$2 10.19,38.62 11.88,40.31 14.06,40.31 15,39.38 16.25,39.38 | R94.P$2 17.3,51.12 v17.27,51.09
  Bottom 0.25: v17.27,51.09 17.27,44.77 v14.69,42.19
IN23  (via drill 0.3)
  Top 0.25: 28.75,39.38 28.75,42.1 LED23.DIN 28.71,42.19 v27.19,42.19 | R111.P$2 39.88,40.94 36.56,40.94 35,39.38 33.75,39.38 33.12,40 R253.P$2 R68.P$2 31.88,40 31.25,39.38 28.75,39.38 | R91.P$2 22.69,38.62 24.38,40.31 26.56,40.31 27.5,39.38 28.75,39.38 | R132.P$2 29.8,51.12 v29.77,51.09
  Bottom 0.25: v29.77,51.09 29.77,44.77 v27.19,42.19
IN24  (via drill 0.3)
  Top 0.25: 41.25,39.38 41.25,42.1 LED24.DIN 41.21,42.19 v39.69,42.19 | R115.P$2 52.38,40.94 49.06,40.94 47.5,39.38 46.25,39.38 45.62,40 R252.P$2 R72.P$2 44.38,40 43.75,39.38 41.25,39.38 | R110.P$2 35.19,38.62 36.88,40.31 39.06,40.31 40,39.38 41.25,39.38 | R136.P$2 42.3,51.12 v42.27,51.09
  Bottom 0.25: v39.69,42.19 42.4,44.9 42.4,50.96 v42.27,51.09
IN25  (via drill 0.3)
  Top 0.25: 53.75,39.38 53.75,42.1 LED25.DIN 53.71,42.19 v52.81,42.19 | R119.P$2 64.88,40.94 61.56,40.94 60,39.38 58.75,39.38 58.12,40 R251.P$2 R76.P$2 56.88,40 56.25,39.38 53.75,39.38 | R114.P$2 47.69,38.62 49.38,40.31 51.56,40.31 52.5,39.38 53.75,39.38 | R140.P$2 54.8,51.12 v54.77,51.09
  Bottom 0.25: v52.81,42.19 55.1,44.48 55.1,50.76 v54.77,51.09
IN26  (via drill 0.3)
  Top 0.25: 66.25,39.38 66.25,42.1 LED26.DIN 66.21,42.19 v64.69,42.19 | R123.P$2 77.38,40.94 74.06,40.94 72.5,39.38 71.25,39.38 70.62,40 R250.P$2 R80.P$2 69.38,40 68.75,39.38 66.25,39.38 | 66.25,39.38 65,39.38 64.06,40.31 61.88,40.31 60.19,38.62 R118.P$2 | R144.P$2 67.3,51.12 v67.27,51.09
  Bottom 0.25: v67.27,51.09 67.27,44.77 v64.69,42.19
IN27  (via drill 0.3)
  Top 0.25: 78.75,39.38 78.75,42.1 LED27.DIN 78.71,42.19 v77.19,42.19 | R127.P$2 89.88,40.94 86.56,40.94 85,39.38 83.75,39.38 83.12,40 R249.P$2 R84.P$2 81.88,40 81.25,39.38 78.75,39.38 | R122.P$2 72.69,38.62 74.38,40.31 76.56,40.31 77.5,39.38 78.75,39.38 | R148.P$2 79.8,51.12 v79.77,51.09
  Bottom 0.25: v79.77,51.09 79.77,44.77 v77.19,42.19
IN28  (via drill 0.3)
  Top 0.25: 91.25,39.38 91.25,42.1 LED28.DIN 91.21,42.19 v89.69,42.19 | R126.P$2 85.19,38.62 86.88,40.31 89.06,40.31 90,39.38 91.25,39.38 | 91.25,39.38 93.75,39.38 94.5,40.12 R248.P$2 R88.P$2 | R152.P$2 92.3,51.12 v92.27,51.09
  Bottom 0.25: v92.27,51.09 92.27,44.77 v89.69,42.19
IN29  (via drill 0.3)
  Top 0.25: LED29.DIN 3.75,54.6 v3.75,53.44 3.75,52.5 4.38,51.88 6.25,51.88 6.88,52.5 R53.P$2 R247.P$2 8.12,52.5 8.75,51.88 10,51.88 11.56,53.44 14.88,53.44 R92.P$2 | R60.P$2 4.8,63.62 v4.77,63.59
  Bottom 0.25: v4.77,63.59 4.77,54.45 v3.75,53.44
IN30  (via drill 0.3)
  Top 0.25: 16.25,51.88 16.25,54.6 LED30.DIN 16.21,54.69 v14.69,54.69 | R130.P$2 27.38,53.44 24.06,53.44 22.5,51.88 21.25,51.88 20.62,52.5 R246.P$2 R89.P$2 19.38,52.5 18.75,51.88 16.25,51.88 | R58.P$2 10.19,51.12 11.88,52.81 14.06,52.81 15,51.88 16.25,51.88 | R98.P$2 17.3,63.62 v17.27,63.59
  Bottom 0.25: v17.27,63.59 17.27,57.27 v14.69,54.69
IN31  (via drill 0.3)
  Top 0.25: 28.75,51.88 28.75,54.6 LED31.DIN 28.71,54.69 v27.19,54.69 | R134.P$2 39.88,53.44 36.56,53.44 35,51.88 33.75,51.88 33.12,52.5 R245.P$2 R108.P$2 31.88,52.5 31.25,51.88 28.75,51.88 | R95.P$2 22.69,51.12 24.38,52.81 26.56,52.81 27.5,51.88 28.75,51.88 | R155.P$2 29.8,63.62 v29.77,63.59
  Bottom 0.25: v29.77,63.59 29.77,57.27 v27.19,54.69
IN32  (via drill 0.3)
  Top 0.25: 41.25,51.88 41.25,54.6 LED32.DIN 41.21,54.69 v39.69,54.69 | R138.P$2 52.38,53.44 49.06,53.44 47.5,51.88 46.25,51.88 45.62,52.5 R244.P$2 R112.P$2 44.38,52.5 43.75,51.88 41.25,51.88 | R133.P$2 35.19,51.12 36.88,52.81 39.06,52.81 40,51.88 41.25,51.88 | R159.P$2 42.3,63.62 v42.27,63.59
  Bottom 0.25: v42.27,63.59 42.27,57.27 v39.69,54.69
IN33  (via drill 0.3)
  Top 0.25: 53.75,51.88 53.75,54.6 LED33.DIN 53.71,54.69 v52.19,54.69 | R142.P$2 64.88,53.44 61.56,53.44 60,51.88 58.75,51.88 58.12,52.5 R243.P$2 R116.P$2 56.88,52.5 56.25,51.88 53.75,51.88 | R137.P$2 47.69,51.12 49.38,52.81 51.56,52.81 52.5,51.88 53.75,51.88 | R163.P$2 54.8,63.62 v54.77,63.59
  Bottom 0.25: v54.77,63.59 54.77,57.27 v52.19,54.69
IN34  (via drill 0.3)
  Top 0.25: 66.25,51.88 66.25,54.6 LED34.DIN 66.21,54.69 v64.69,54.69 | R146.P$2 77.38,53.44 74.06,53.44 72.5,51.88 71.25,51.88 70.62,52.5 R242.P$2 R120.P$2 69.38,52.5 68.75,51.88 66.25,51.88 | R141.P$2 60.19,51.12 61.88,52.81 64.06,52.81 65,51.88 66.25,51.88 | R167.P$2 67.3,63.62 v67.27,63.59
  Bottom 0.25: v67.27,63.59 67.27,57.27 v64.69,54.69
IN35  (via drill 0.3)
  Top 0.25: 78.75,51.88 78.75,54.6 LED35.DIN 78.71,54.69 v77.19,54.69 | R150.P$2 89.88,53.44 86.56,53.44 85,51.88 83.75,51.88 83.12,52.5 R241.P$2 R124.P$2 81.88,52.5 81.25,51.88 78.75,51.88 | R145.P$2 72.69,51.12 74.38,52.81 76.56,52.81 77.5,51.88 78.75,51.88 | R171.P$2 79.8,63.62 v79.77,63.59
  Bottom 0.25: v79.77,63.59 79.77,57.27 v77.19,54.69
IN36  (via drill 0.3)
  Top 0.25: 91.25,51.88 91.25,54.6 LED36.DIN 91.21,54.69 v89.69,54.69 | R149.P$2 85.19,51.12 86.88,52.81 89.06,52.81 90,51.88 91.25,51.88 | 91.25,51.88 93.75,51.88 94.38,52.5 R128.P$2 R240.P$2 | R175.P$2 92.3,63.62 v92.27,63.59
  Bottom 0.25: v92.27,63.59 92.27,57.27 v89.69,54.69
IN37  (via drill 0.3)
  Top 0.25: LED37.DIN 3.75,67.1 v3.75,65.94 3.75,65 4.38,64.38 6.25,64.38 6.88,65 R56.P$2 R239.P$2 8.12,65 8.75,64.38 10,64.38 11.56,65.94 14.88,65.94 R96.P$2 | R63.P$2 4.8,76.12 v4.77,76.09
  Bottom 0.25: v4.77,76.09 4.77,66.95 v3.75,65.94
IN38  (via drill 0.3)
  Top 0.25: 16.25,64.38 16.25,67.1 LED38.DIN 16.21,67.19 v14.69,67.19 | R153.P$2 27.38,65.94 24.06,65.94 22.5,64.38 21.25,64.38 20.62,65 R238.P$2 R93.P$2 19.38,65 18.75,64.38 16.25,64.38 | R61.P$2 10.19,63.62 11.88,65.31 14.06,65.31 15,64.38 16.25,64.38 | R102.P$2 17.3,76.12 v17.27,76.09
  Bottom 0.25: v17.27,76.09 17.27,69.77 v14.69,67.19
IN39  (via drill 0.3)
  Top 0.25: 28.75,64.38 28.75,67.1 LED39.DIN 28.71,67.19 v27.19,67.19 | R157.P$2 39.88,65.94 36.56,65.94 35,64.38 33.75,64.38 33.12,65 R237.P$2 R131.P$2 31.88,65 31.25,64.38 28.75,64.38 | R99.P$2 22.69,63.62 24.38,65.31 26.56,65.31 27.5,64.38 28.75,64.38 | R178.P$2 29.8,76.12 v29.77,76.09
  Bottom 0.25: v29.77,76.09 29.77,69.77 v27.19,67.19
IN40  (via drill 0.3)
  Top 0.25: 41.25,64.38 41.25,67.1 LED40.DIN 41.21,67.19 v39.69,67.19 | R161.P$2 52.38,65.94 49.06,65.94 47.5,64.38 46.25,64.38 45.62,65 R236.P$2 R135.P$2 44.38,65 43.75,64.38 41.25,64.38 | R156.P$2 35.19,63.62 36.88,65.31 39.06,65.31 40,64.38 41.25,64.38 | R182.P$2 42.3,76.12 v42.27,76.09
  Bottom 0.25: v42.27,76.09 42.27,69.77 v39.69,67.19
IN41  (via drill 0.3)
  Top 0.25: 53.75,64.38 53.75,67.1 LED41.DIN 53.71,67.19 v52.19,67.19 | R165.P$2 64.88,65.94 61.56,65.94 60,64.38 58.75,64.38 58.12,65 R235.P$2 R139.P$2 56.88,65 56.25,64.38 53.75,64.38 | R160.P$2 47.69,63.62 49.38,65.31 51.56,65.31 52.5,64.38 53.75,64.38 | R186.P$2 54.8,76.12 v54.77,76.09
  Bottom 0.25: v54.77,76.09 54.77,69.77 v52.19,67.19
IN42  (via drill 0.3)
  Top 0.25: 66.25,64.38 66.25,67.1 LED42.DIN 66.21,67.19 v64.69,67.19 | R169.P$2 77.38,65.94 74.06,65.94 72.5,64.38 71.25,64.38 70.62,65 R234.P$2 R143.P$2 69.38,65 68.75,64.38 66.25,64.38 | R164.P$2 60.19,63.62 61.88,65.31 64.06,65.31 65,64.38 66.25,64.38 | R190.P$2 67.3,76.12 v67.27,76.09
  Bottom 0.25: v67.27,76.09 67.27,69.77 v64.69,67.19
IN43  (via drill 0.3)
  Top 0.25: 78.75,64.38 78.75,67.1 LED43.DIN 78.71,67.19 v77.19,67.19 | R173.P$2 89.88,65.94 86.56,65.94 85,64.38 83.75,64.38 83.12,65 R233.P$2 R147.P$2 81.88,65 81.25,64.38 78.75,64.38 | R168.P$2 72.69,63.62 74.38,65.31 76.56,65.31 77.5,64.38 78.75,64.38 | R194.P$2 79.8,76.12 v79.77,76.09
  Bottom 0.25: v79.77,76.09 79.77,69.77 v77.19,67.19
IN44  (via drill 0.3)
  Top 0.25: 91.25,64.38 91.25,67.1 LED44.DIN 91.21,67.19 v89.69,67.19 | R172.P$2 85.19,63.62 86.88,65.31 89.06,65.31 90,64.38 91.25,64.38 | 91.25,64.38 93.75,64.38 94.38,65 R151.P$2 R232.P$2 | R198.P$2 92.3,76.12 v92.27,76.09
  Bottom 0.25: v92.27,76.09 92.27,69.77 v89.69,67.19
IN45  (via drill 0.3)
  Top 0.25: LED45.DIN 3.75,79.6 v3.75,78.44 3.75,77.5 4.38,76.88 6.25,76.88 6.88,77.5 R59.P$2 R231.P$2 8.12,77.5 8.75,76.88 10,76.88 11.56,78.44 14.88,78.44 R100.P$2 | R66.P$2 v5.62,87.81
  Bottom 0.25: v5.62,87.81 5.62,80.31 v3.75,78.44
IN46  (via drill 0.3)
  Top 0.25: 16.25,76.88 16.25,79.6 LED46.DIN 16.21,79.69 v14.69,79.69 | R176.P$2 27.38,78.44 24.06,78.44 22.5,76.88 21.25,76.88 20.62,77.5 R230.P$2 R97.P$2 19.38,77.5 18.75,76.88 16.25,76.88 | R64.P$2 10.19,76.12 11.88,77.81 14.06,77.81 15,76.88 16.25,76.88 | R105.P$2 17.3,88.62 v17.27,88.59
  Bottom 0.25: v17.27,88.59 17.27,82.27 v14.69,79.69
IN47  (via drill 0.3)
  Top 0.25: 28.75,76.88 28.75,79.6 LED47.DIN 28.71,79.69 v27.19,79.69 | R180.P$2 39.88,78.44 36.56,78.44 35,76.88 33.75,76.88 33.12,77.5 R229.P$2 R154.P$2 31.88,77.5 31.25,76.88 28.75,76.88 | R103.P$2 22.69,76.12 24.38,77.81 26.56,77.81 27.5,76.88 28.75,76.88 | R200.P$2 29.8,88.62 v29.77,88.59
  Bottom 0.25: v29.77,88.59 29.77,82.27 v27.19,79.69
IN48  (via drill 0.3)
  Top 0.25: 41.25,76.88 41.25,79.6 LED48.DIN 41.21,79.69 v39.69,79.69 | R184.P$2 52.38,78.44 49.06,78.44 47.5,76.88 46.25,76.88 45.62,77.5 R228.P$2 R158.P$2 44.38,77.5 43.75,76.88 41.25,76.88 | R179.P$2 35.19,76.12 36.88,77.81 39.06,77.81 40,76.88 41.25,76.88 | R203.P$2 42.3,88.62 v42.27,88.59
  Bottom 0.25: v42.27,88.59 42.27,82.27 v39.69,79.69
IN49  (via drill 0.3)
  Top 0.25: 53.75,76.88 53.75,79.6 LED49.DIN 53.71,79.69 v52.19,79.69 | R188.P$2 64.88,78.44 61.56,78.44 60,76.88 58.75,76.88 58.12,77.5 R227.P$2 R162.P$2 56.88,77.5 56.25,76.88 53.75,76.88 | R183.P$2 47.69,76.12 49.38,77.81 51.56,77.81 52.5,76.88 53.75,76.88 | R206.P$2 54.8,88.62 v54.77,88.59
  Bottom 0.25: v54.77,88.59 54.77,82.27 v52.19,79.69
IN50  (via drill 0.3)
  Top 0.25: 66.25,76.88 66.25,79.6 LED50.DIN 66.21,79.69 v64.69,79.69 | R192.P$2 77.38,78.44 74.06,78.44 72.5,76.88 71.25,76.88 70.62,77.5 R226.P$2 R166.P$2 69.38,77.5 68.75,76.88 66.25,76.88 | R187.P$2 60.19,76.12 61.88,77.81 64.06,77.81 65,76.88 66.25,76.88 | R209.P$2 67.3,88.62 v67.27,88.59
  Bottom 0.25: v67.27,88.59 67.27,82.27 v64.69,79.69
IN51  (via drill 0.3)
  Top 0.25: 78.75,76.88 78.75,79.6 LED51.DIN 78.71,79.69 v77.19,79.69 | R196.P$2 89.88,78.44 86.56,78.44 85,76.88 83.75,76.88 83.12,77.5 R225.P$2 R170.P$2 81.88,77.5 81.25,76.88 78.75,76.88 | R191.P$2 72.69,76.12 74.38,77.81 76.56,77.81 77.5,76.88 78.75,76.88 | R212.P$2 79.8,88.62 v79.77,88.59
  Bottom 0.25: v79.77,88.59 79.77,82.27 v77.19,79.69
IN52  (via drill 0.3)
  Top 0.25: 91.25,76.88 91.25,79.6 LED52.DIN 91.21,79.69 v89.69,79.69 | R195.P$2 85.19,76.12 86.88,77.81 89.06,77.81 90,76.88 91.25,76.88 | 91.25,76.88 93.75,76.88 94.38,77.5 R174.P$2 R224.P$2 | R215.P$2 92.3,88.62 v92.27,88.59
  Bottom 0.25: v92.27,88.59 92.27,82.27 v89.69,79.69
IN53
  Top 0.25: LED53.DIN 3.75,92.1 3.75,90 4.38,89.38 6.25,89.38 6.88,90 R62.P$2 R223.P$2 8.12,90 8.75,89.38 10,89.38 11.56,90.94 14.88,90.94 R104.P$2
IN54
  Top 0.25: LED54.DIN 16.25,92.1 16.25,89.38 | R199.P$2 27.38,90.94 24.06,90.94 22.5,89.38 21.25,89.38 20.62,90 R222.P$2 R101.P$2 19.38,90 18.75,89.38 16.25,89.38 | R67.P$2 10.19,88.62 11.88,90.31 14.06,90.31 15,89.38 16.25,89.38
IN55
  Top 0.25: LED55.DIN 28.75,92.1 28.75,89.38 | 28.75,89.38 31.25,89.38 31.88,90 R177.P$2 R221.P$2 33.12,90 33.75,89.38 35,89.38 36.56,90.94 39.88,90.94 R202.P$2 | R106.P$2 22.69,88.62 24.38,90.31 26.56,90.31 27.5,89.38 28.75,89.38
IN56
  Top 0.25: LED56.DIN 41.25,92.1 41.25,89.38 | 41.25,89.38 43.75,89.38 44.38,90 R181.P$2 R220.P$2 45.62,90 46.25,89.38 47.5,89.38 49.06,90.94 52.38,90.94 R205.P$2 | R201.P$2 35.19,88.62 36.88,90.31 39.06,90.31 40,89.38 41.25,89.38
IN57
  Top 0.25: LED57.DIN 53.75,92.1 53.75,89.38 | 53.75,89.38 56.25,89.38 56.88,90 R185.P$2 R219.P$2 58.12,90 58.75,89.38 60,89.38 61.56,90.94 64.88,90.94 R208.P$2 | R204.P$2 47.69,88.62 49.38,90.31 51.56,90.31 52.5,89.38 53.75,89.38
IN58
  Top 0.25: LED58.DIN 66.25,92.1 66.25,89.38 | R211.P$2 77.38,90.94 74.06,90.94 72.5,89.38 71.25,89.38 70.62,90 R218.P$2 R189.P$2 69.38,90 68.75,89.38 66.25,89.38 | R207.P$2 60.19,88.62 61.88,90.31 64.06,90.31 65,89.38 66.25,89.38
IN59
  Top 0.25: LED59.DIN 78.75,92.1 78.75,89.38 | R214.P$2 89.88,90.94 86.56,90.94 85,89.38 83.75,89.38 83.12,90 R217.P$2 R193.P$2 81.88,90 81.25,89.38 78.75,89.38 | R210.P$2 72.69,88.62 74.38,90.31 76.56,90.31 77.5,89.38 78.75,89.38
IN60
  Top 0.25: LED60.DIN 91.25,92.1 91.25,89.38 | 91.25,89.38 93.75,89.38 94.38,90 R197.P$2 R216.P$2 | R213.P$2 85.19,88.62 86.88,90.31 89.06,90.31 90,89.38 91.25,89.38
LE  (via drill 0.3)
  Top 0.25: v89.7,35 90.4,35.7 TP4.P$1
  Bottom 0.25: IC2.20 v89.7,35 91.2,35 93.3,32.9 93.3,30.4 91.3,28.4 91.3,27.2 92,26.5 92,25.1 90.79,23.89 IC1.4
LED-DATA  (via drill 0.3)
  Top 0.25: R283.P$1 R284.P$1 51.38,35 48.75,35 v48.44,35.31
  Bottom 0.25: v48.44,35.31 48.44,44.94 46.19,47.19 X2.3
LED-DATA-OUT  (via drill 0.3)
  Top 0.25: R356.P$1 51.38,60 49.25,60 R357.P$1 v49.06,59.38
  Bottom 0.25: X2.4 48.75,48.77 48.75,59.06 v49.06,59.38
LED-DATA-OUT-UC  (via drill 0.3)
  Top 0.25: 50.31,34.19 R332.P$1 R333.P$1 R334.P$1 R335.P$1 | 50.31,34.19 R331.P$1 60.44,34.06 72.69,34.06 R330.P$1 | 50.31,34.19 R353.P$2 | R328.P$1 v93.44,35.62 | R329.P$1 85.94,37.81 v86.56,38.44 | v72.81,34.77 R330.P$1 | R287.P$1 73.75,34.19 R330.P$1
  Bottom 0.25: v93.44,35.62 90.62,38.44 v86.56,38.44 73.75,38.44 72.81,37.5 v72.81,34.77
LED-DATA-UC  (via drill 0.3)
  Top 0.25: R255.P$1 8.12,38.12 8.44,37.81 10.31,37.81 12.19,39.69 13.75,39.69 15.62,37.81 20.62,37.81 | 20.62,37.81 22.81,37.81 24.69,39.69 26.25,39.69 28.12,37.81 33.12,37.81 | 33.12,37.81 35.31,37.81 37.19,39.69 38.75,39.69 40.62,37.81 45.62,37.81 | 45.62,37.81 47.81,37.81 49.69,39.69 50.5,39.69 | 50.5,39.69 51.25,39.69 53.12,37.81 58.12,37.81 | 58.12,37.81 60.31,37.81 62.19,39.69 63.75,39.69 65.62,37.81 70.62,37.81 | 70.62,37.81 72.81,37.81 74.69,39.69 75.94,39.69 v76.25,39.38 R286.P$1 | v95.31,39.14 95.47,38.98 R248.P$1 | R250.P$1 70.62,37.81 | R251.P$1 58.12,37.81 | R252.P$1 45.62,37.81 | R253.P$1 33.12,37.81 | R254.P$1 20.62,37.81 | R249.P$1 83.12,38.98 v82.97,39.14 | R281.P$2 50.5,39.69
  Bottom 0.25: v95.31,39.14 v82.97,39.14 82.73,39.38 v76.25,39.38
MOSI  (via drill 0.3)
  Top 0.25: TP3.P$1 87.4,37.04 v88.03,36.41
  Bottom 0.25: IC2.19 87.4,35.79 v88.03,36.41
N$1  (via drill 0.3)
  Top 0.25: R278.P$1 50.31,2.81 v50.94,3.44 | v50.31,12.19 R279.P$1 | R280.P$1 v50.31,24.69 | R281.P$1 v50.31,36.88 50.31,36.69 R284.P$2
  Bottom 0.25: v50.94,3.44 50.31,4.06 v50.31,12.19 v50.31,24.69 v50.31,36.88
N$2
  Bottom 0.25: IC1.23 85.86,25.16 86.9,26.2 86.9,29.12 86.53,29.5 R5.P$2
N$4
  Bottom 0.5: 99,24 99.25,23.75 99.25,7.75 99,7.5
  Bottom 1: 99,23.1 99,24 99,95 arc90 95,99 5,99 arc90 1,95 1,5 arc90 5,1 95,1 arc90 99,5 99,7.5 99,8
N$5  (via drill 0.3)
  Top 0.25: R2.P$1 v50.31,87.19 | R270.P$1 v50.31,74.69 | v50.31,62.19 R271.P$1 | R282.P$1 50.31,50 v50,49.69 | v51.88,37.81 52.81,36.88 R283.P$2
  Bottom 0.25: v50.31,87.19 v50.31,74.69 v50.31,62.19 50.31,50 v50,49.69 50,47.5 50.31,47.19 50.31,38.75 51.25,37.81 v51.88,37.81
N$6  (via drill 0.3)
  Top 0.25: R286.P$2 75.94,36.75 v75.94,36.25
  Bottom 0.25: IC2.16 85.9,35.59 85.94,35.62 85,36.56 76.25,36.56 v75.94,36.25
N$7
  Top 0.25: R295.P$1 R294.P$1 R293.P$1 R292.P$1 49.88,96.69 | R288.P$1 92.5,96.69 R289.P$1 R290.P$1 R291.P$1 50,96.69 49.88,96.69 | R348.P$2 49.88,96.69
N$8
  Top 0.25: R296.P$1 92.5,84.19 R297.P$1 R298.P$1 R299.P$1 50.31,84.19 | 50.31,84.19 R300.P$1 R301.P$1 R302.P$1 R303.P$1 | R349.P$2 50.31,84.19
N$9
  Top 0.25: R311.P$1 R310.P$1 R309.P$1 R308.P$1 50.31,71.69 | 50.31,71.69 R307.P$1 R306.P$1 R305.P$1 92.5,71.69 R304.P$1 | R350.P$2 50.31,71.69
N$10